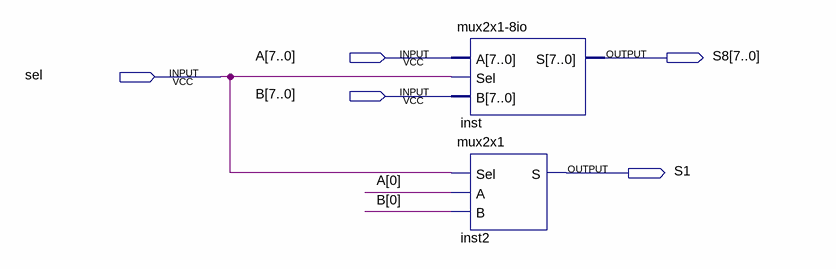
[diagram p0: schematic sheet]
// Quartus schematic test_mux.bdf as structural Verilog: 2 symbols, 5 pins
module test_mux (
  input  [7:0] A,
  input  sel,
  input  [7:0] B,
  output [7:0] S8,
  output S1
);

  \mux2x1-8io  inst (.A(A), .Sel(sel), .B(B), .S(S8));
  mux2x1 inst2 (.Sel(sel), .A(A[0]), .B(B[0]), .S(S1));
endmodule
